# Altium schematic sheet Reset_Circuit.SchDoc
size A4; SheetNumber: 6; SheetTotal: 6
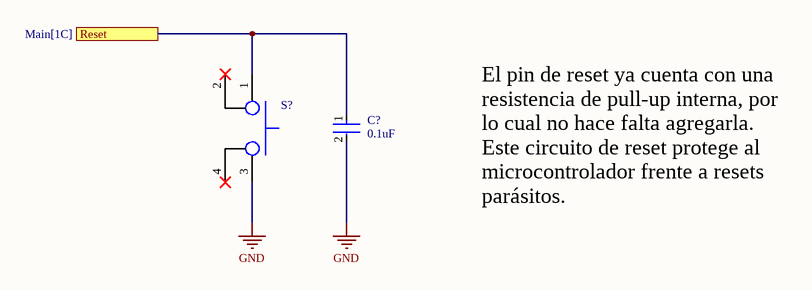
[diagram p0: Reset_Circuit.SchDoc]

## Parts
C?  value 0.1uF  [FP-CC0805-0_85-MFG]  (hidden comment: CC0805KRX7R8BB104)
S?  Tactile push button  [HP03_Series]  (value not drawn)

## Ports
Reset (see Main[1C])

## Nets
GND: C?.2 S?.3
Reset: C?.1 S?.1 ; port Reset

Not connected (* = marked no-connect by the designer): S? 2* 4*

## Notes on the sheet
- El pin de reset ya cuenta con una resistencia de pull-up interna, por lo cual no hace falta agregarla.
  Este circuito de reset protege al microcontrolador frente a resets parásitos.

## Library data of the parts
C? = CMP-1036-04410-2: CAP CER 0.1UF 25V X7R 0805; Manufacturer: Yageo; Tolerance: 0.1; Material: Ceramic; Capacitance: 100 nF; ComponentLink2URL: http://www.yageo.com/documents/recent/UPY-GPHC_Y5V_6.3V-to-50V_8.pdf; Category: Cap; Mouser Description: Multilayer Ceramic Capacitors MLCC - SMD/SMT 100nF 25V X7R 10%; Manufacturer Part Number: CC0805KRX7R8BB104; Device Class L1: Passive Components; Footprint Url: http://www.yageo.com/exep/pages/download/literatures/UPY-C_GEN_24.pdf; Height: 0.95mm; Digikey Description: CAP CER 0.1UF 25V X7R 0805; Lead Free: Yes; Temperature Range High: +85°C; Temperature: -30°C to +85°C; Ipc Land Pattern Name: CAPC200125X85; Automotive: No; Octopart: https://octopart.com/cc0805krx7r8bb104-yageo-39467766; Device Class L2: Capacitors; Temperature Characteristic: X7R; Voltage Rating: 25 V; ComponentLink2Description: Datasheet; Temperature Range Low: -30°C; Device Class L3: Ceramic Capacitors; RoHS: TRUE; Package: CC0805-0.85